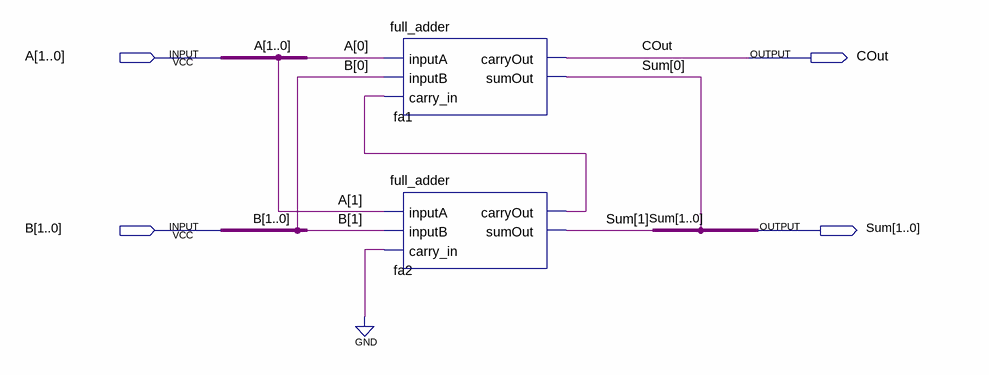
[diagram p0: schematic sheet]
// Quartus schematic carry_ripple_adder.bdf as structural Verilog: 2 symbols, 4 pins
module carry_ripple_adder (
  input  [1:0] A,
  input  [1:0] B,
  output COut,
  output [1:0] Sum
);

  wire fa2_carryout;

  full_adder fa1 (.inputA(A[0]), .inputB(B[0]), .carry_in(fa2_carryout), .carryOut(COut), .sumOut(Sum[0]));
  full_adder fa2 (.inputA(A[1]), .inputB(B[1]), .carry_in(1'b0), .carryOut(fa2_carryout), .sumOut(Sum[1]));
endmodule
